# EasyEDA schematic Motor Mount 2024 Feb 07.json
TITLE: Sheet_1; REV: 1.0; Date: 2024-02-06; Sheet: 1/1; Drawn By: jack27; Company: Your Company
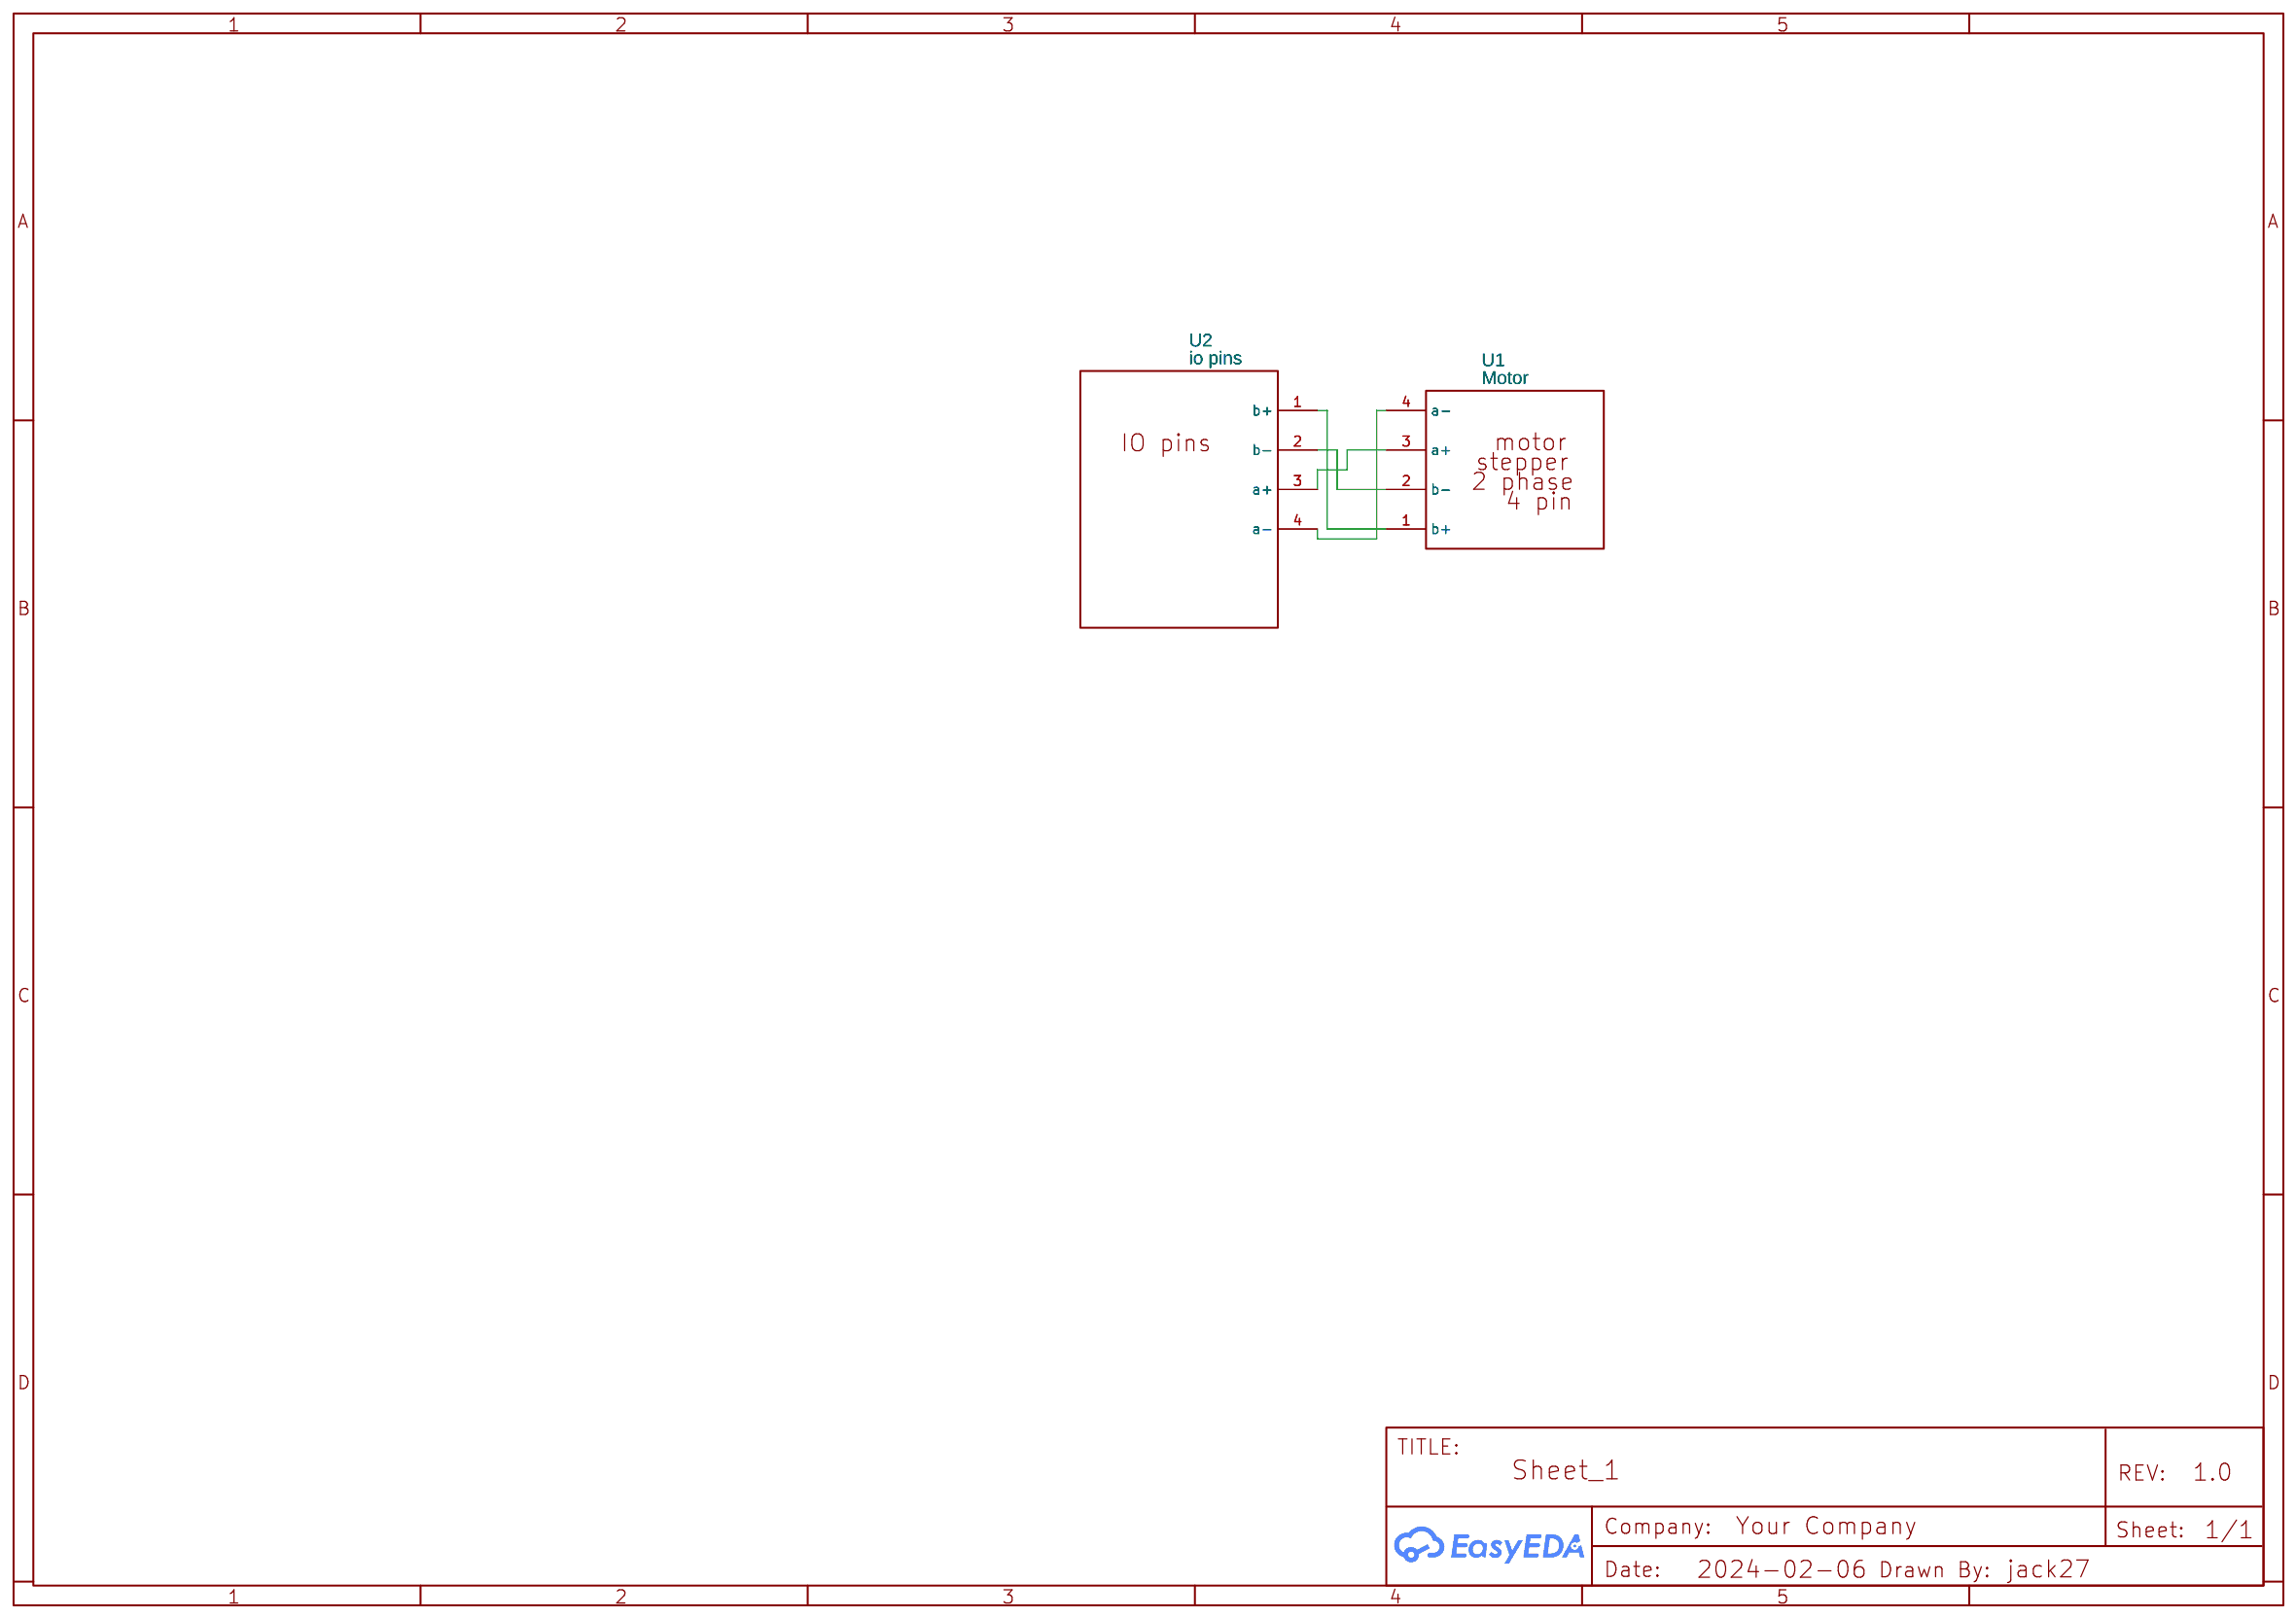
[diagram p0: schematic sheet]

## Parts
U1  Motor  [MOTOR FOOTPRINT]
U2  io pins  [IO PINS]

## Library data of the parts
U1 = Motor: Contributor: jack27; Package Display: No
U2 = io pins: Contributor: jack27

## Nets
Net-(U1-1): U1.1(b+) U2.1(b+)
Net-(U1-2): U1.2(b-) U2.2(b-)
Net-(U1-3): U1.3(a+) U2.3(a+)
Net-(U1-4): U1.4(a-) U2.4(a-)
